# Altium project Control_ bath.PrjPcb
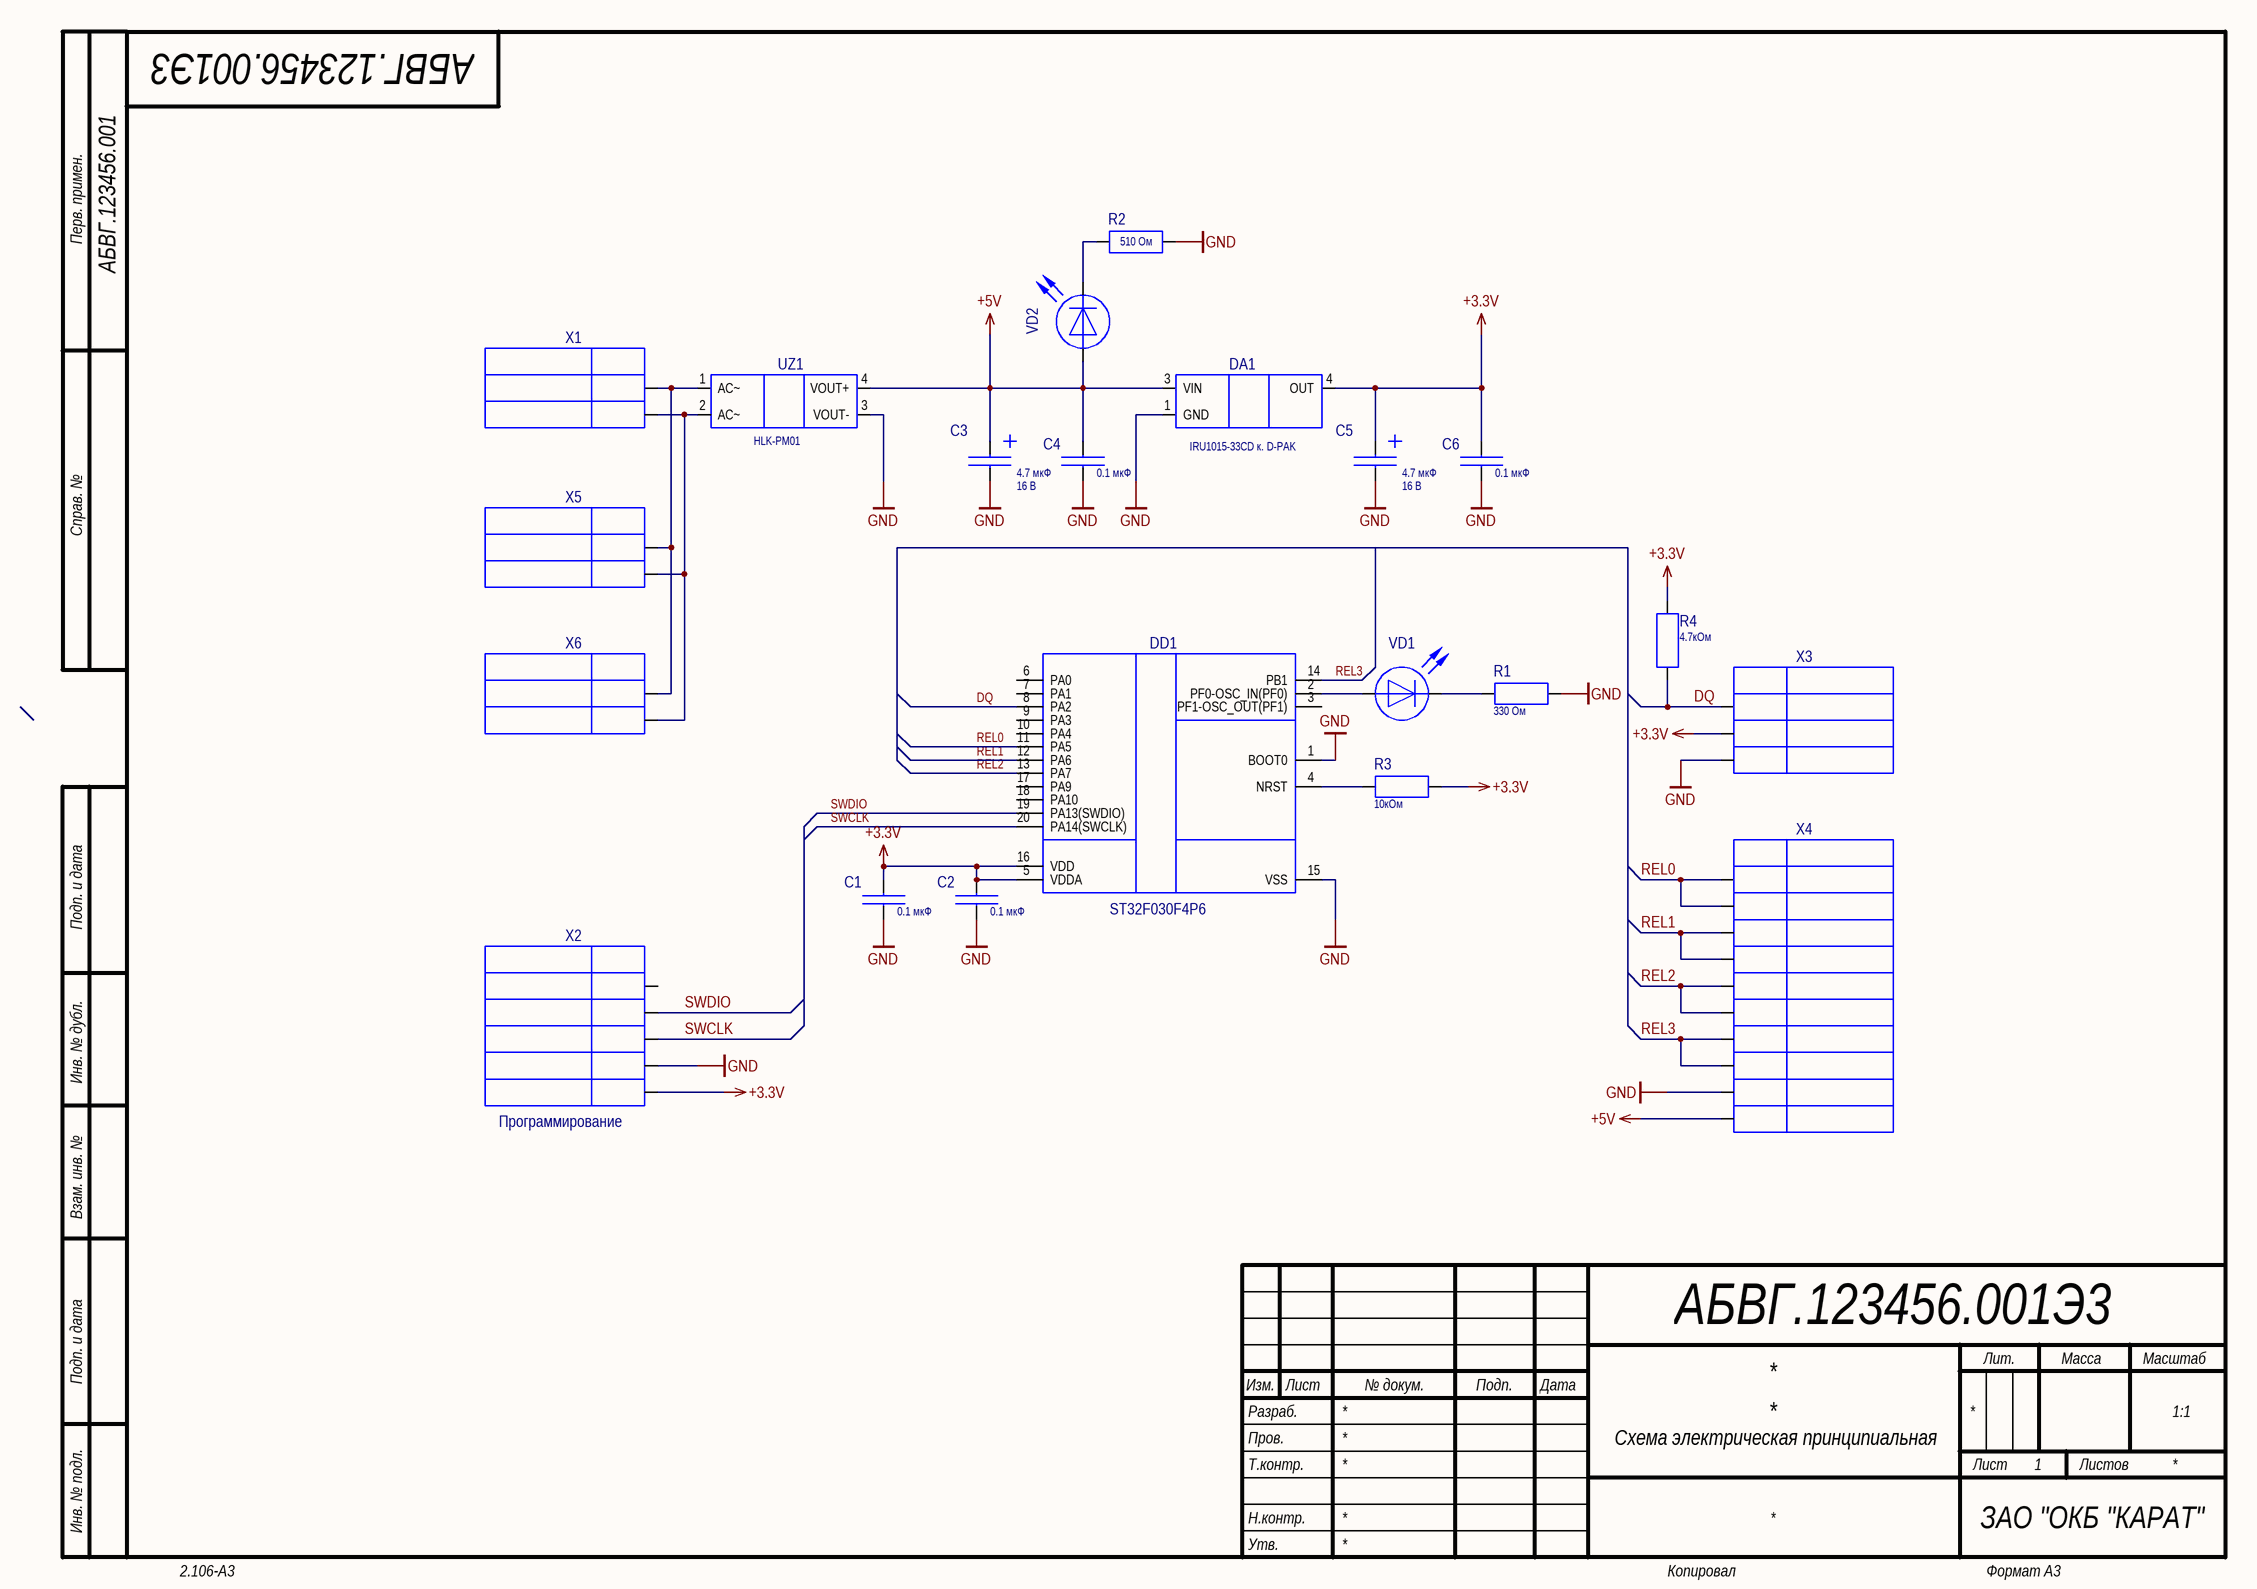
[diagram p0: Sheet1.SchDoc]
1 sheet, 21 parts. Net scope: global (net labels, ports and power ports of the same name join across sheets).
Board file: control_bath_pcb.PcbDoc

## Sheet Sheet1.SchDoc
size 420 x 297 mm; CompanyName: ЗАО "ОКБ "КАРАТ"; Organization: ЗАО "ОКБ "КАРАТ"; Address1: Address1; Address2: Address2; Address3: Address3; Address4: Address4; DocumentNumber: АБВГ.123456.001Э3; SheetNumber: 1; Scale: 1:1; DocumentType: Схема электрическая принципиальная; FirstReferrence: АБВГ.123456.001

### Parts
C1  value 0.1 мкФ  [C1206]  (hidden comment: C_2)
C2  value 0.1 мкФ  [C1206]  (hidden comment: C_2)
C3  value 4.7 мкФ  Power/Voltage: 16 В  [B]  (hidden comment: C_E)
C4  value 0.1 мкФ  [C1206]  (hidden comment: C_2)
C5  value 4.7 мкФ  Power/Voltage: 16 В  [B]  (hidden comment: C_E)
C6  value 0.1 мкФ  [C1206]  (hidden comment: C_2)
DA1  ManufacturerPartNumber: IRU1015-33CD к. D-PAK  [D-PAK]  (hidden comment: LM1117)
DD1  ManufacturerPartNumber: ST32F030F4P6  [SSOP20]  (hidden comment: ST32F030F4)
R1  value 330 Ом  [R1206]  (hidden comment: R_1)
R2  value 510 Ом  [R1206]  (hidden comment: R_1)
R3  value 10кОм  [R1206]  (hidden comment: R_1)
R4  value 4.7кОм  [R1206]  (hidden comment: R_1)
UZ1  HLK-PM01  [HLK-PM01]
VD1  LED  [L1206]  (value not drawn)
VD2  LED  [L1206]  (value not drawn)
X1  PLS2  [DG126-5-02P-14-00AH]  (value not drawn)
X2  PLS5  [HDR1X5]  (value not drawn)
X3  PLS3  [HDR1X3]  (value not drawn)
X4  BH10  [BH10]  (value not drawn)
X5  PLS2  [DG126-5-02P-14-00AH]  (value not drawn)
X6  PLS2  [DG126-5-02P-14-00AH]  (value not drawn)

### Nets
+3.3V: C1.2 C2.2 C5.1 C6.2 DA1.4(OUT) DD1.5(VDDA) DD1.16(VDD) R3.2 R4.2 X2.5 X3.2
+5V: C3.1 C4.2 DA1.3(VIN) UZ1.4(VOUT+) VD2.1 X4.10
GND: C1.1 C2.1 C3.2 C4.1 C5.2 C6.1 DA1.1(GND) DD1.1(BOOT0) DD1.15(VSS) R1.2 R2.1 UZ1.3(VOUT-) X2.4 X3.3 X4.9
DQ: DD1.8(PA2) R4.1 X3.1
REL0: DD1.11(PA5) X4.1 X4.2
REL1: DD1.12(PA6) X4.3 X4.4
REL2: DD1.13(PA7) X4.5 X4.6
REL3: DD1.14(PB1) X4.7 X4.8
SWCLK: DD1.20(PA14(SWCLK)) X2.3
SWDIO: DD1.19(PA13(SWDIO)) X2.2
NetDD1_2: DD1.2(PF0-OSC_IN(PF0)) VD1.1
NetDD1_4: DD1.4(NRST) R3.1
NetR1_1: R1.1 VD1.2
NetR2_2: R2.2 VD2.2
NetUZ1_1: UZ1.1(AC~) X1.2 X5.2 X6.2
NetUZ1_2: UZ1.2(AC~) X1.1 X5.1 X6.1

Not connected (* = marked no-connect by the designer): DD1 3(PF1-OSC_OUT(PF1)) 6(PA0) 7(PA1) 9(PA3) 10(PA4) 17(PA9) 18(PA10); X2 1

### Notes on the sheet
- (near X2) Программирование
- Перв. примен.
- Справ. №
- Подп. и дата
- Инв. № дубл.
- Взам. инв. №
- Разраб.
- Изм.
- Лист
- № докум.
- Подп.
- Дата
- Лит.
- Масса
- Масштаб
- Пров.
- Т.контр.
- Листов
- Инв. № подл.
- Утв.
- Н.контр.
- 2.106-A3
- Копировал
- Формат А3

### Library data of the parts
C1 C2 C4 C6 = C_2: Name: X7R, 1206; Power/Voltage: 50В; Tolerance: 5%; Type: Конденсатор; BCDId: *; Manufacturer: *; ManufacturerPartNumber: *; Rem: *; TKE/TCK: *; TU/GOST: *; ValueBOM: *
C3 C5 = C_E: Name: Тип B; Tolerance: 10%; Type: Конденсатор; BCDId: *; Manufacturer: *; Package: *; Rem: *; TKE/TCK: *; TU/GOST: *; ValueBOM: *
DA1 = LM1117: Manufacturer: ф. IR; BCDId: *; TU/GOST: *; Type: Микросхема; ValueBOM: *
DD1 = ST32F030F4: Manufacturer: ф. ST; BCDId: *; TU/GOST: *; Type: Микросхема; ValueBOM: *
R1-R4 = R_1: Name: 1206; Tolerance: 5%; BCDId: *; Manufacturer: *; ManufacturerPartNumber: *; Power/Voltage: *; Rem: *; TKE/TCK: *; TU/GOST: *; Type: Резистор; ValueBOM: *
UZ1 = HLK-PM01: Manufacturer: ф. Hi-link; ManufacturerPartNumber: HLK-PM01 5В/3Вт; BCDId: *; TU/GOST: *; Type: Вторичный источник питания; ValueBOM: *
VD1 = LED: ManufacturerPartNumber: Светодиод; Type: Диод; BCDId: *; TU/GOST: *; ValueBOM: *; Pack: SMD 1206
VD2 = LED: Manufacturer: ф. Betlux Electronics; ManufacturerPartNumber: Светодиод BL-LS0603UHR (красный); Type: Диод; BCDId: *; TU/GOST: *; ValueBOM: *; Pack: SMD 0603
X1 X5 X6 = PLS2: ManufacturerPartNumber: DG126-5.0-02P; BCDId: *; Manufacturer: *; TU/GOST: *; Type: Разъём; ValueBOM: *
X2 = PLS5: Manufacturer: ф. Ningbo Zhenqin Electronic; BCDId: *; ManufacturerPartNumber: PLS5; TU/GOST: *; Type: Разъём; ValueBOM: *
X3 = PLS3: Manufacturer: ф. Ningbo Zhenqin Electronic; BCDId: *; ManufacturerPartNumber: PLS3; TU/GOST: *; Type: Разъём; ValueBOM: *
X4 = BH10: Manufacturer: ф. Ningbo Zhenqin Electronic; ManufacturerPartNumber: BH-10; BCDId: *; TU/GOST: *; Type: Разъём; ValueBOM: *